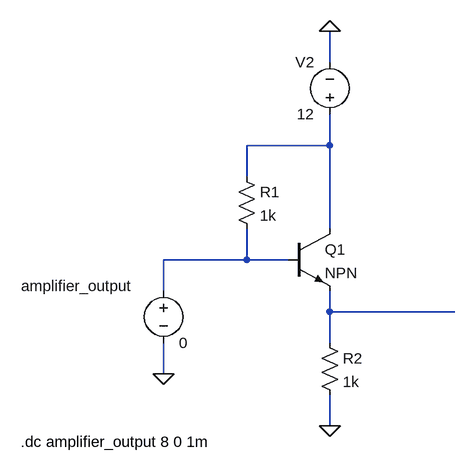
[diagram p0: schematic emitter_follower.asc]
emitter_follower.asc, the LTspice schematic file:
Version 4
SHEET 1 880 680
WIRE 208 -144 208 -192
WIRE 208 -16 208 -64
WIRE 208 -16 80 -16
WIRE 80 32 80 -16
WIRE 208 112 208 -16
WIRE 80 160 80 112
WIRE 80 160 -48 160
WIRE 144 160 80 160
WIRE -48 208 -48 160
WIRE 208 240 208 208
WIRE 400 240 208 240
WIRE 208 288 208 240
WIRE -48 336 -48 288
WIRE 208 416 208 368
FLAG -48 336 0
FLAG 208 416 0
FLAG 208 -192 0
SYMBOL npn 144 112 R0
SYMATTR InstName Q1
SYMBOL voltage -48 192 R0
WINDOW 0 -219 8 Left 2
WINDOW 123 0 0 Left 0
WINDOW 39 0 0 Left 0
SYMATTR InstName amplifier_output
SYMATTR Value 0
SYMBOL voltage 208 -48 R180
WINDOW 0 24 96 Left 2
WINDOW 3 24 16 Left 2
WINDOW 123 0 0 Left 0
WINDOW 39 0 0 Left 0
SYMATTR InstName V2
SYMATTR Value 12
SYMBOL res 64 16 R0
SYMATTR InstName R1
SYMATTR Value 1k
SYMBOL res 192 272 R0
SYMATTR InstName R2
SYMATTR Value 1k
TEXT -268 440 Left 2 !.dc amplifier_output 8 0 1m

The netlist it stands for:
* emitter_follower.asc
Q1 N001 N002 N003 0 NPN
V§amplifier_output N002 0 0
V2 N001 0 12
R1 N001 N002 1k
R2 N003 0 1k
.model NPN NPN
.model PNP PNP
.lib standard.bjt
.dc amplifier_output 8 0 1m
.backanno
.end